# Altium project PCB_BobBreakout.PrjPcb
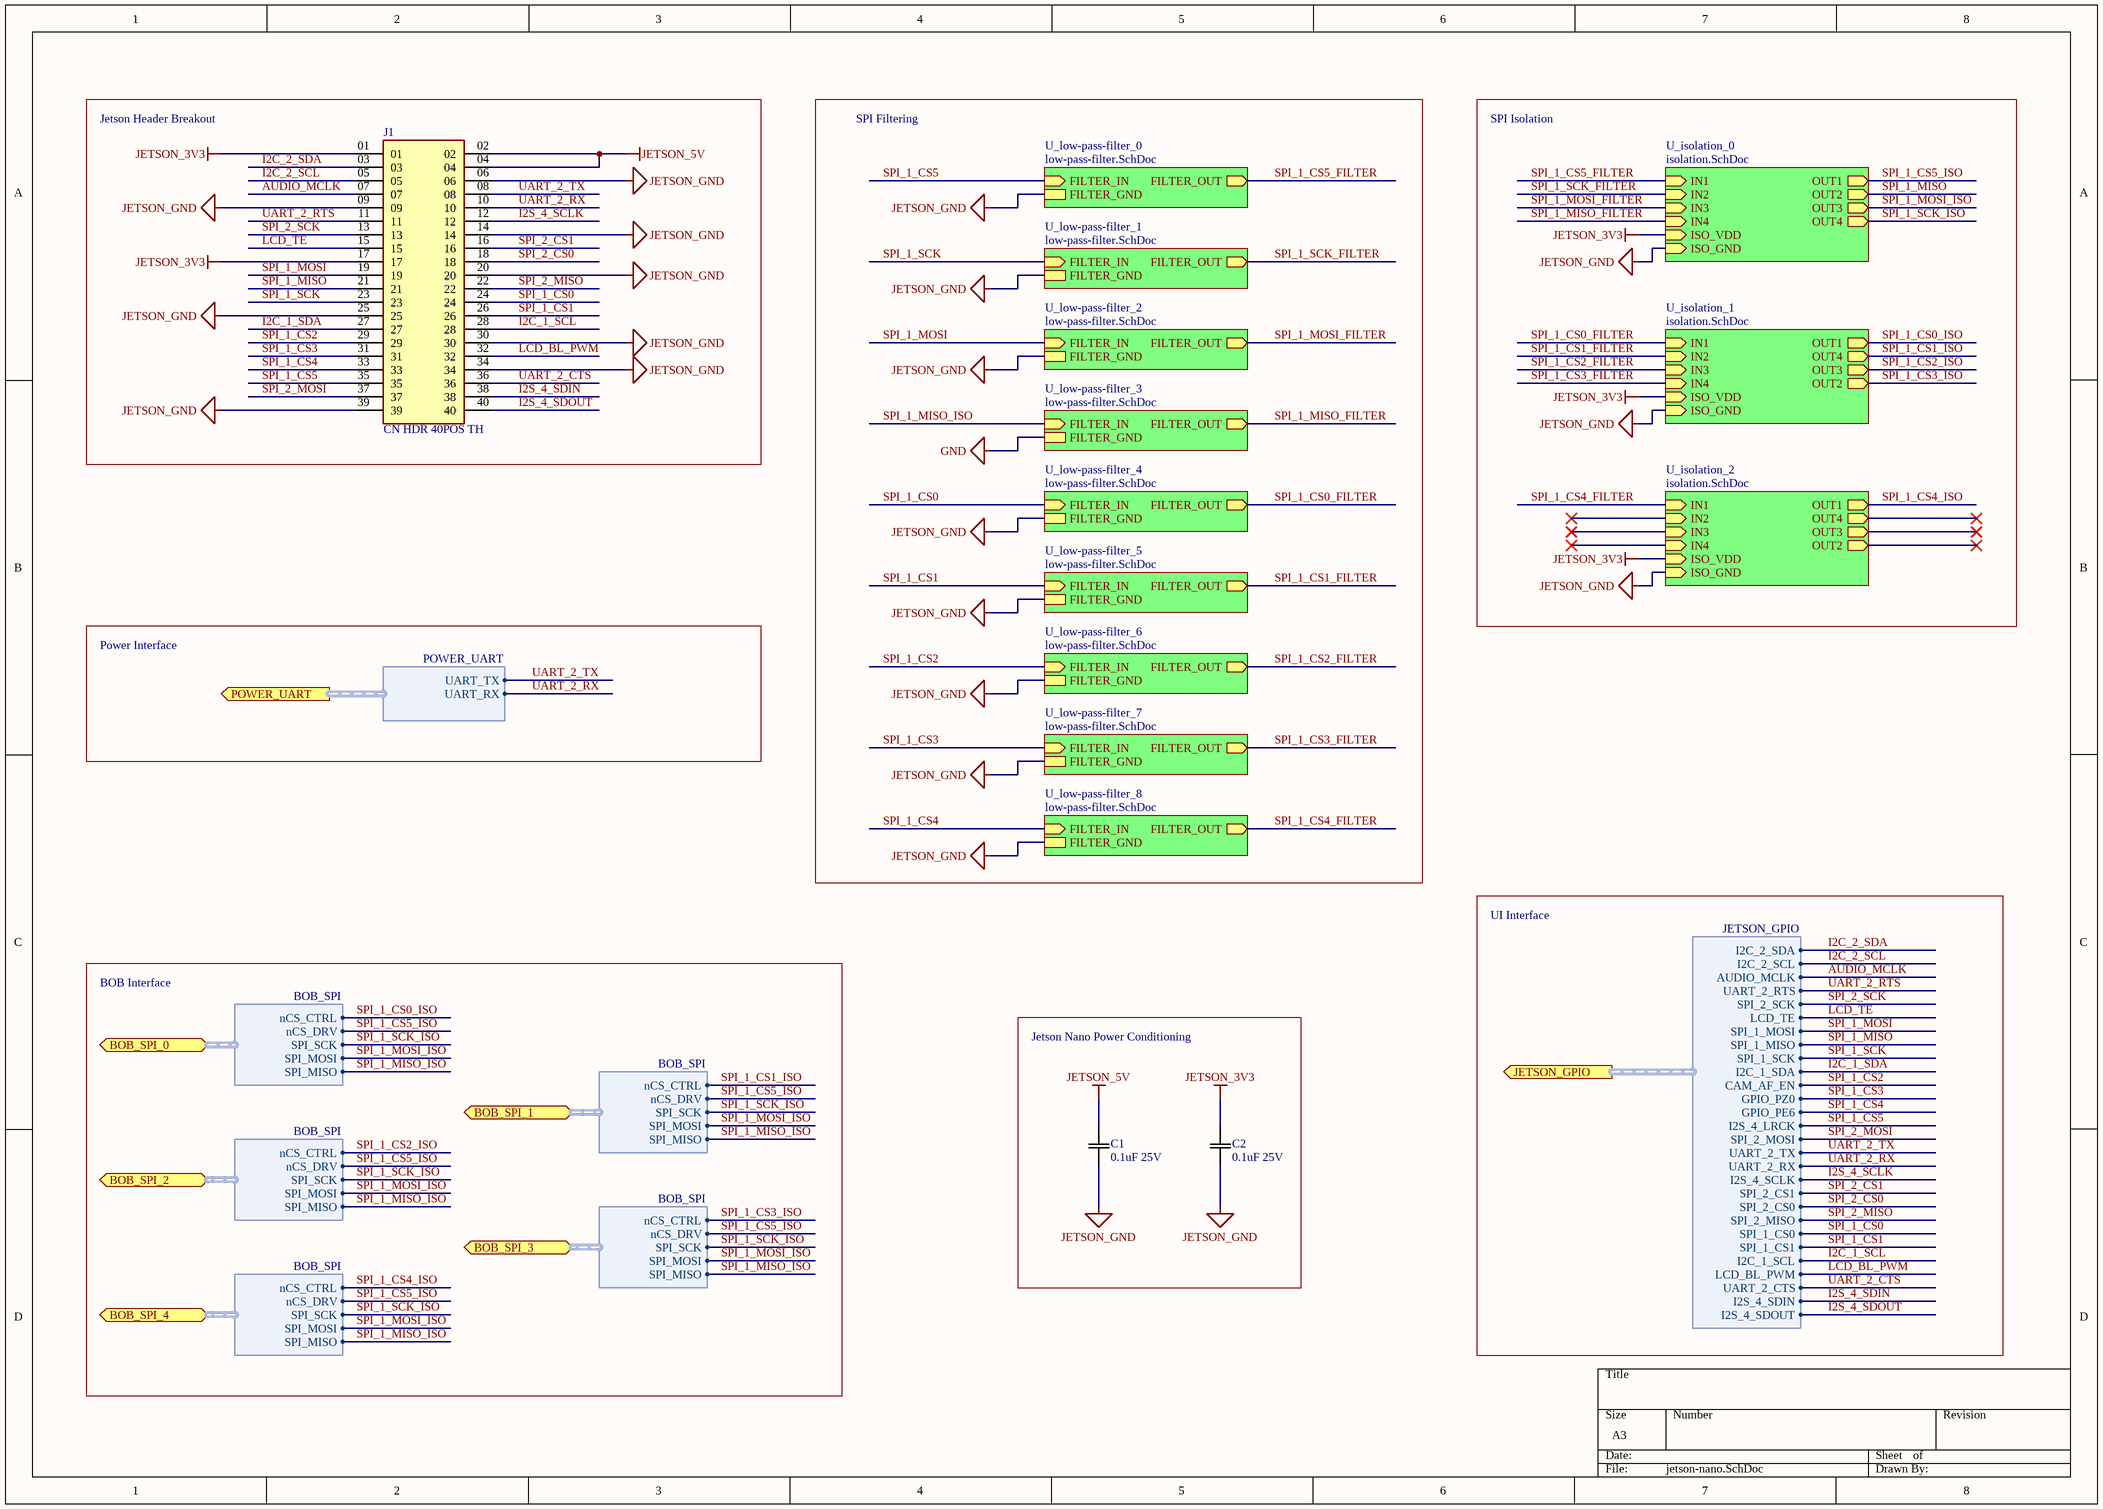
[diagram p0: jetson-nano.SchDoc]
3 sheets, 18 parts. Net scope: hierarchical (ports join the sheet entries above them; power ports are global).
Board file: layout.PcbDoc
Sheets:
  jetson-nano.SchDoc
  power.SchDoc
  ui.SchDoc

## Sheet jetson-nano.SchDoc
size A3; SheetNumber: 2; SheetTotal: 8

### Parts
C1  0.1uF 25V  [0805]
C2  0.1uF 25V  [0805]
J1  CN HDR 40POS TH  [SAMTEC_SSQ-120-22-G-D]

### Blocks framed on the sheet
Jetson Header Breakout: J1
Jetson Nano Power Conditioning: C1 C2

### Sub-sheets
U_isolation_0 = isolation.SchDoc (file not in this document): OUT1 (out), IN1 (in), IN2 (in), IN3 (in), OUT4 (out), OUT3 (out), OUT2 (out), IN4 (in), ISO_VDD (in), ISO_GND (in)
U_isolation_1 = isolation.SchDoc (file not in this document): OUT1 (out), IN1 (in), IN2 (in), IN3 (in), OUT4 (out), OUT3 (out), OUT2 (out), IN4 (in), ISO_VDD (in), ISO_GND (in)
U_isolation_2 = isolation.SchDoc (file not in this document): OUT1 (out), IN1 (in), IN2 (in), IN3 (in), OUT4 (out), OUT3 (out), OUT2 (out), IN4 (in), ISO_VDD (in), ISO_GND (in)
U_low-pass-filter_0 = low-pass-filter.SchDoc (file not in this document): FILTER_OUT (out), FILTER_IN (in), FILTER_GND
U_low-pass-filter_1 = low-pass-filter.SchDoc (file not in this document): FILTER_OUT (out), FILTER_IN (in), FILTER_GND
U_low-pass-filter_2 = low-pass-filter.SchDoc (file not in this document): FILTER_OUT (out), FILTER_IN (in), FILTER_GND
U_low-pass-filter_3 = low-pass-filter.SchDoc (file not in this document): FILTER_OUT (out), FILTER_IN (in), FILTER_GND
U_low-pass-filter_4 = low-pass-filter.SchDoc (file not in this document): FILTER_OUT (out), FILTER_IN (in), FILTER_GND
U_low-pass-filter_5 = low-pass-filter.SchDoc (file not in this document): FILTER_OUT (out), FILTER_IN (in), FILTER_GND
U_low-pass-filter_6 = low-pass-filter.SchDoc (file not in this document): FILTER_OUT (out), FILTER_IN (in), FILTER_GND
U_low-pass-filter_7 = low-pass-filter.SchDoc (file not in this document): FILTER_OUT (out), FILTER_IN (in), FILTER_GND
U_low-pass-filter_8 = low-pass-filter.SchDoc (file not in this document): FILTER_OUT (out), FILTER_IN (in), FILTER_GND

### Ports
BOB_SPI_0 (bidir, harness BOB_SPI), BOB_SPI_1 (bidir, harness BOB_SPI), BOB_SPI_2 (bidir, harness BOB_SPI), BOB_SPI_3 (bidir, harness BOB_SPI), BOB_SPI_4 (bidir, harness BOB_SPI), JETSON_GPIO (out, harness JETSON_GPIO), POWER_UART (out, harness POWER_UART)

### Harnesses
BOB_SPI: nCS_CTRL, nCS_DRV, SPI_SCK, SPI_MOSI, SPI_MISO
POWER_UART: UART_TX, UART_RX
JETSON_GPIO: I2C_2_SDA, I2C_2_SCL, AUDIO_MCLK, UART_2_RTS, SPI_2_SCK, LCD_TE, SPI_1_MOSI, SPI_1_MISO, SPI_1_SCK, I2C_1_SDA, CAM_AF_EN, GPIO_PZ0, GPIO_PE6, I2S_4_LRCK, SPI_2_MOSI, UART_2_TX, UART_2_RX, I2S_4_SCLK, SPI_2_CS1, SPI_2_CS0, SPI_2_MISO, SPI_1_CS0, SPI_1_CS1, I2C_1_SCL, LCD_BL_PWM, UART_2_CTS, I2S_4_SDIN, I2S_4_SDOUT

### Nets
JETSON_3V3: C2.1(C1) J1.01 J1.17 ; sheet U_isolation_0/ISO_VDD, sheet U_isolation_1/ISO_VDD, sheet U_isolation_2/ISO_VDD
JETSON_5V: C1.1(C1) J1.02 J1.04
JETSON_GND: C1.2(C2) C2.2(C2) J1.06 J1.09 J1.14 J1.20 J1.25 J1.30 J1.34 J1.39 ; sheet U_isolation_0/ISO_GND, sheet U_isolation_1/ISO_GND, sheet U_isolation_2/ISO_GND, sheet U_low-pass-filter_0/FILTER_GND, sheet U_low-pass-filter_1/FILTER_GND, sheet U_low-pass-filter_2/FILTER_GND, sheet U_low-pass-filter_4/FILTER_GND, sheet U_low-pass-filter_5/FILTER_GND, sheet U_low-pass-filter_6/FILTER_GND, sheet U_low-pass-filter_7/FILTER_GND, sheet U_low-pass-filter_8/FILTER_GND
AUDIO_MCLK: J1.07 ; port JETSON_GPIO.AUDIO_MCLK
I2C_1_SCL: J1.28 ; port JETSON_GPIO.I2C_1_SCL
I2C_1_SDA: J1.27 ; port JETSON_GPIO.I2C_1_SDA
I2C_2_SCL: J1.05 ; port JETSON_GPIO.I2C_2_SCL
I2C_2_SDA: J1.03 ; port JETSON_GPIO.I2C_2_SDA
I2S_4_SCLK: J1.12 ; port JETSON_GPIO.I2S_4_SCLK
I2S_4_SDIN: J1.38 ; port JETSON_GPIO.I2S_4_SDIN
I2S_4_SDOUT: J1.40 ; port JETSON_GPIO.I2S_4_SDOUT
LCD_BL_PWM: J1.32 ; port JETSON_GPIO.LCD_BL_PWM
LCD_TE: J1.15 ; port JETSON_GPIO.LCD_TE
SPI_1_CS0: J1.24 ; sheet U_low-pass-filter_4/FILTER_IN, port JETSON_GPIO.SPI_1_CS0
SPI_1_CS0_FILTER: sheet U_isolation_1/IN1, sheet U_low-pass-filter_4/FILTER_OUT
SPI_1_CS0_ISO: sheet U_isolation_1/OUT1, port BOB_SPI_0.nCS_CTRL
SPI_1_CS1: J1.26 ; sheet U_low-pass-filter_5/FILTER_IN, port JETSON_GPIO.SPI_1_CS1
SPI_1_CS1_FILTER: sheet U_isolation_1/IN2, sheet U_low-pass-filter_5/FILTER_OUT
SPI_1_CS1_ISO: sheet U_isolation_1/OUT4, port BOB_SPI_1.nCS_CTRL
SPI_1_CS2: J1.29 ; sheet U_low-pass-filter_6/FILTER_IN, port JETSON_GPIO.CAM_AF_EN
SPI_1_CS2_FILTER: sheet U_isolation_1/IN3, sheet U_low-pass-filter_6/FILTER_OUT
SPI_1_CS2_ISO: sheet U_isolation_1/OUT3, port BOB_SPI_2.nCS_CTRL
SPI_1_CS3: J1.31 ; sheet U_low-pass-filter_7/FILTER_IN, port JETSON_GPIO.GPIO_PZ0
SPI_1_CS3_FILTER: sheet U_isolation_1/IN4, sheet U_low-pass-filter_7/FILTER_OUT
SPI_1_CS3_ISO: sheet U_isolation_1/OUT2, port BOB_SPI_3.nCS_CTRL
SPI_1_CS4: J1.33 ; sheet U_low-pass-filter_8/FILTER_IN, port JETSON_GPIO.GPIO_PE6
SPI_1_CS4_FILTER: sheet U_isolation_2/IN1, sheet U_low-pass-filter_8/FILTER_OUT
SPI_1_CS4_ISO: sheet U_isolation_2/OUT1, port BOB_SPI_4.nCS_CTRL
SPI_1_CS5: J1.35 ; sheet U_low-pass-filter_0/FILTER_IN, port JETSON_GPIO.I2S_4_LRCK
SPI_1_CS5_FILTER: sheet U_isolation_0/IN1, sheet U_low-pass-filter_0/FILTER_OUT
SPI_1_CS5_ISO: sheet U_isolation_0/OUT1, port BOB_SPI_0.nCS_DRV, port BOB_SPI_2.nCS_DRV, port BOB_SPI_1.nCS_DRV, port BOB_SPI_3.nCS_DRV, port BOB_SPI_4.nCS_DRV
SPI_1_MISO: J1.21 ; sheet U_isolation_0/OUT2, port JETSON_GPIO.SPI_1_MISO
SPI_1_MISO_FILTER: sheet U_isolation_0/IN4, sheet U_low-pass-filter_3/FILTER_OUT
SPI_1_MISO_ISO: sheet U_low-pass-filter_3/FILTER_IN, port BOB_SPI_0.SPI_MISO, port BOB_SPI_2.SPI_MISO, port BOB_SPI_1.SPI_MISO, port BOB_SPI_3.SPI_MISO, port BOB_SPI_4.SPI_MISO
SPI_1_MOSI: J1.19 ; sheet U_low-pass-filter_2/FILTER_IN, port JETSON_GPIO.SPI_1_MOSI
SPI_1_MOSI_FILTER: sheet U_isolation_0/IN3, sheet U_low-pass-filter_2/FILTER_OUT
SPI_1_MOSI_ISO: sheet U_isolation_0/OUT3, port BOB_SPI_0.SPI_MOSI, port BOB_SPI_2.SPI_MOSI, port BOB_SPI_1.SPI_MOSI, port BOB_SPI_3.SPI_MOSI, port BOB_SPI_4.SPI_MOSI
SPI_1_SCK: J1.23 ; sheet U_low-pass-filter_1/FILTER_IN, port JETSON_GPIO.SPI_1_SCK
SPI_1_SCK_FILTER: sheet U_isolation_0/IN2, sheet U_low-pass-filter_1/FILTER_OUT
SPI_1_SCK_ISO: sheet U_isolation_0/OUT4, port BOB_SPI_0.SPI_SCK, port BOB_SPI_2.SPI_SCK, port BOB_SPI_1.SPI_SCK, port BOB_SPI_3.SPI_SCK, port BOB_SPI_4.SPI_SCK
SPI_2_CS0: J1.18 ; port JETSON_GPIO.SPI_2_CS0
SPI_2_CS1: J1.16 ; port JETSON_GPIO.SPI_2_CS1
SPI_2_MISO: J1.22 ; port JETSON_GPIO.SPI_2_MISO
SPI_2_MOSI: J1.37 ; port JETSON_GPIO.SPI_2_MOSI
SPI_2_SCK: J1.13 ; port JETSON_GPIO.SPI_2_SCK
UART_2_CTS: J1.36 ; port JETSON_GPIO.UART_2_CTS
UART_2_RTS: J1.11 ; port JETSON_GPIO.UART_2_RTS
UART_2_RX: J1.10 ; port POWER_UART.UART_RX, port JETSON_GPIO.UART_2_RX
UART_2_TX: J1.08 ; port POWER_UART.UART_TX, port JETSON_GPIO.UART_2_TX

### Notes on the sheet
- SPI Filtering
- SPI Isolation
- Power Interface
- UI Interface
- BOB Interface

### Library data of the parts
C1 C2 = CAP 0.1uF 25V: CAP CER 0.1UF 25V X7R 0805/0603; Tolerance: 10%; Value: 0.1uF; Temperature Coefficient: X7R; Rating: 25V; Operating Temperature: -55°C ~ 125°C
J1 = CN HDR 40POS TH: SSQ - Samtec 2.54mm Square Tail Dual Row Socket Strip 8.5mm Profile; MP: SSQ-120-22-G-D; Value: *; Price: None; Package: None; MF: Samtec; Check_prices: https://www.snapeda.com/parts/SSQ-120-22-G-D/Samtec/view-part/3393219/?ref=eda; Availability: In Stock; SnapEDA_Link: https://www.snapeda.com/parts/SSQ-120-22-G-D/Samtec/view-part/3393219/?ref=snap; Purchase-URL: https://pricing.snapeda.com/search/part/SSQ-120-22-G-D/?ref=eda; Digikey: S6104-ND

## Sheet power.SchDoc
size A4; SheetNumber: 5; SheetTotal: 8
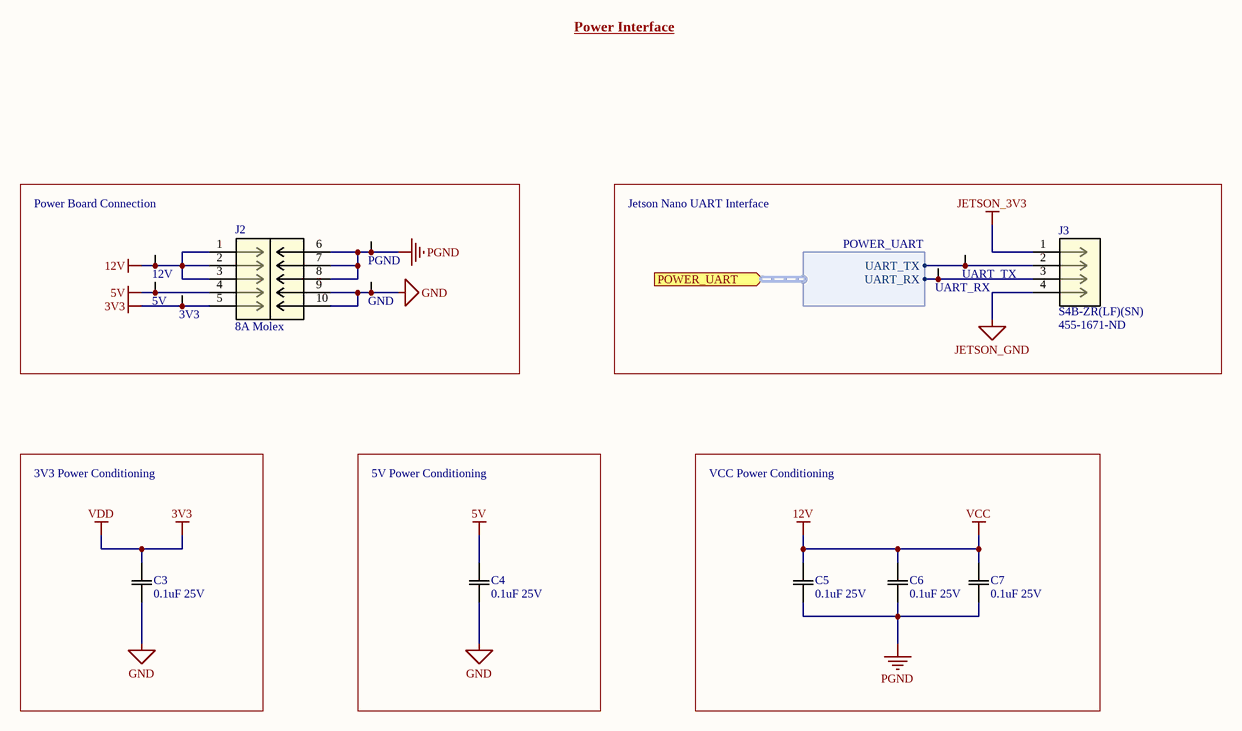
[diagram p1: power.SchDoc]

### Parts
3V3  Test Point (Via)  [TP]  (value not drawn)
5V  Test Point (Via)  [TP]  (value not drawn)
12V  Test Point (Via)  [TP]  (value not drawn)
C3  0.1uF 25V  [0805]
C4  0.1uF 25V  [0805]
C5  0.1uF 25V  [0805]
C6  0.1uF 25V  [0805]
C7  0.1uF 25V  [0805]
GND  Test Point (Via)  [TP]  (value not drawn)
J2  8A Molex  [MOLEX_0430451012]
J3  S4B-ZR(LF)(SN)  Supplier Part Number 1: 455-1671-ND  [CN S4B-ZR(LF)(SN)_JST]
PGND  Test Point (Via)  [TP]  (value not drawn)
UART_RX  Test Point (Via)  [TP]  (value not drawn)
UART_TX  Test Point (Via)  [TP]  (value not drawn)

### Blocks framed on the sheet
Power Board Connection: 3V3 5V 12V GND J2 PGND
Jetson Nano UART Interface: J3 UART_RX UART_TX
3V3 Power Conditioning: C3
5V Power Conditioning: C4
VCC Power Conditioning: C5-C7

### Ports
POWER_UART (in, harness POWER_UART)

### Harnesses
POWER_UART: UART_TX, UART_RX

### Nets
3V3: 3V3.1 C3.1(C1) J2.5  [also labelled VDD]
5V: 5V.1 C4.1(C1) J2.4
12V: 12V.1 C5.1(C1) C6.1(C1) C7.1(C1) J2.1 J2.2 J2.3  [also labelled VCC]
GND: C3.2(C2) C4.2(C2) GND.1 J2.9 J2.10
JETSON_3V3: J3.1
JETSON_GND: J3.4
PGND: C5.2(C2) C6.2(C2) C7.2(C2) J2.6 J2.7 J2.8 PGND.1
NetJ3_2: J3.2 UART_TX.1 ; port POWER_UART.UART_TX
NetJ3_3: J3.3 UART_RX.1 ; port POWER_UART.UART_RX

### Notes on the sheet
- Power Interface

### Library data of the parts
C3-C7 = CAP 0.1uF 25V: as C1 on sheet jetson-nano; Value: 0.1uF; Temperature Coefficient: X7R; Rating: 25V; Operating Temperature: -55°C ~ 125°C
J2 = CN HDR 10POS MOLEX 0430451012: CONN HEADER VERT 10POS 3MM; Number of Terminals/Pins: 10; Contact Resistance: 10mR; Connector Type: Male Pin; Number of Ports: 1; Max Voltage Rating (AC): 250V; Pitch: 0.118inch; Supplier 1: Digi-Key; Manufacturer: Molex; Manufacturer Part Number: 0430451012; RoHS: Yes; Category: Headers and Wire Housings; Stock 1: 22123; Pricing 1: 1=2.46000, 10=2.09300, 80=1.72925, 1224=1.36521, 6120=1.21049 (USD); Mount: Through Hole; Color: Black; Contact Material: Brass; Contact Plating: Tin; Housing Color: Black; Housing Material: Polymer; Min Operating Temperature: -40°C; Max Operating Temperature: 105°C; Packaging: Tray; Number of Rows: 2; Number of Positions: 10; Termination: Solder; Number of Contacts: 10; Orientation: Straight; Series: Micro-Fit 3.0™ 43045; Fastening Type: Ramp; Contact Type: Male Pin; Length: 19.15mm; Row Spacing: 0.118inch; Depth: 8.77mm; Flammability Rating: UL94 V-0; RoHS Compliant: Yes; ComponentLink1URL: http://components.arrow.com/part/dataview/0323_01052363?src-supplier=Arrow+Europe; ComponentLink1Description: http://components.arrow.com/part/dataview/0323_01052363?src-supplier=Arrow+Europe; ComponentLink2URL: http://components.arrow.com/part/dataview/2943140S3689940N3303?src-supplier=Arrow+Electronics; ComponentLink2Description: http://components.arrow.com/part/dataview/2943140S3689940N3303?src-supplier=Arrow+Electronics; Supplier Part Number 1: WM1793-ND
J3 = CN HDR 4POS JST ZR: Connector Header Through Hole, Right Angle 4 position 0.059" (1.50mm); Mfr_Name: JST; Copyright: Copyright (C) 2021 Ultra Librarian. All rights reserved.; Manufacturer_Part_Number: S4B-ZR(LF)(SN); Digi-Key_Part_Number_1: 455-1671-ND; RefDes: RefDes; Type: DEV; Supplier 1: Digi-Key

## Sheet ui.SchDoc
size A4; SheetNumber: 7; SheetTotal: 7
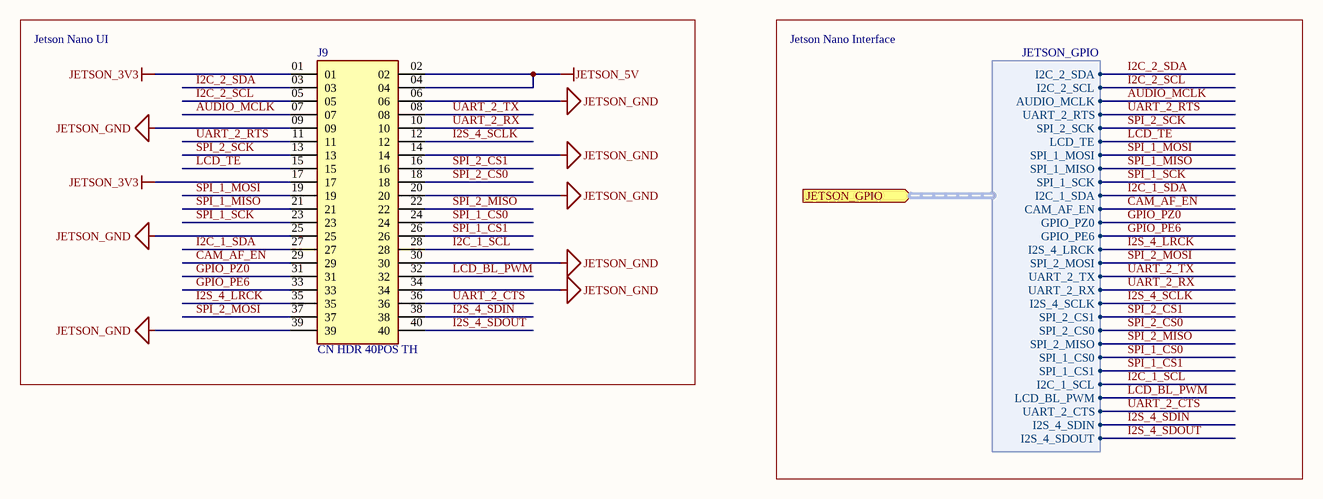
[diagram p2: ui.SchDoc]

### Parts
J9  CN HDR 40POS TH  [SAMTEC_SSQ-120-22-G-D]

### Blocks framed on the sheet
Jetson Nano UI: J9

### Ports
JETSON_GPIO (in, harness JETSON_GPIO)

### Harnesses
JETSON_GPIO: I2C_2_SDA, I2C_2_SCL, AUDIO_MCLK, UART_2_RTS, SPI_2_SCK, LCD_TE, SPI_1_MOSI, SPI_1_MISO, SPI_1_SCK, I2C_1_SDA, CAM_AF_EN, GPIO_PZ0, GPIO_PE6, I2S_4_LRCK, SPI_2_MOSI, UART_2_TX, UART_2_RX, I2S_4_SCLK, SPI_2_CS1, SPI_2_CS0, SPI_2_MISO, SPI_1_CS0, SPI_1_CS1, I2C_1_SCL, LCD_BL_PWM, UART_2_CTS, I2S_4_SDIN, I2S_4_SDOUT

### Nets
JETSON_3V3: J9.01 J9.17
JETSON_5V: J9.02 J9.04
JETSON_GND: J9.06 J9.09 J9.14 J9.20 J9.25 J9.30 J9.34 J9.39
AUDIO_MCLK: J9.07 ; port JETSON_GPIO.AUDIO_MCLK
CAM_AF_EN: J9.29 ; port JETSON_GPIO.CAM_AF_EN
GPIO_PE6: J9.33 ; port JETSON_GPIO.GPIO_PE6
GPIO_PZ0: J9.31 ; port JETSON_GPIO.GPIO_PZ0
I2C_1_SCL: J9.28 ; port JETSON_GPIO.I2C_1_SCL
I2C_1_SDA: J9.27 ; port JETSON_GPIO.I2C_1_SDA
I2C_2_SCL: J9.05 ; port JETSON_GPIO.I2C_2_SCL
I2C_2_SDA: J9.03 ; port JETSON_GPIO.I2C_2_SDA
I2S_4_LRCK: J9.35 ; port JETSON_GPIO.I2S_4_LRCK
I2S_4_SCLK: J9.12 ; port JETSON_GPIO.I2S_4_SCLK
I2S_4_SDIN: J9.38 ; port JETSON_GPIO.I2S_4_SDIN
I2S_4_SDOUT: J9.40 ; port JETSON_GPIO.I2S_4_SDOUT
LCD_BL_PWM: J9.32 ; port JETSON_GPIO.LCD_BL_PWM
LCD_TE: J9.15 ; port JETSON_GPIO.LCD_TE
SPI_1_CS0: J9.24 ; port JETSON_GPIO.SPI_1_CS0
SPI_1_CS1: J9.26 ; port JETSON_GPIO.SPI_1_CS1
SPI_1_MISO: J9.21 ; port JETSON_GPIO.SPI_1_MISO
SPI_1_MOSI: J9.19 ; port JETSON_GPIO.SPI_1_MOSI
SPI_1_SCK: J9.23 ; port JETSON_GPIO.SPI_1_SCK
SPI_2_CS0: J9.18 ; port JETSON_GPIO.SPI_2_CS0
SPI_2_CS1: J9.16 ; port JETSON_GPIO.SPI_2_CS1
SPI_2_MISO: J9.22 ; port JETSON_GPIO.SPI_2_MISO
SPI_2_MOSI: J9.37 ; port JETSON_GPIO.SPI_2_MOSI
SPI_2_SCK: J9.13 ; port JETSON_GPIO.SPI_2_SCK
UART_2_CTS: J9.36 ; port JETSON_GPIO.UART_2_CTS
UART_2_RTS: J9.11 ; port JETSON_GPIO.UART_2_RTS
UART_2_RX: J9.10 ; port JETSON_GPIO.UART_2_RX
UART_2_TX: J9.08 ; port JETSON_GPIO.UART_2_TX

### Notes on the sheet
- Jetson Nano Interface

### Library data of the parts
J9 = CN HDR 40POS TH: as J1 on sheet jetson-nano; Value: *; Price: None; Package: None; MF: Samtec; Check_prices: https://www.snapeda.com/parts/SSQ-120-22-G-D/Samtec/view-part/3393219/?ref=eda; Availability: In Stock; SnapEDA_Link: https://www.snapeda.com/parts/SSQ-120-22-G-D/Samtec/view-part/3393219/?ref=snap; Purchase-URL: https://pricing.snapeda.com/search/part/SSQ-120-22-G-D/?ref=eda; Digikey: S6104-ND

## Nets that join several sheets
JETSON_3V3: jetson-nano (C2.1 J1.01 J1.17), power (J3.1), ui (J9.01 J9.17)
JETSON_5V: jetson-nano (C1.1 J1.02 J1.04), ui (J9.02 J9.04)
JETSON_GND: jetson-nano (10 pins), power (J3.4), ui (8 pins)